# Altium schematic sheet SpeakeEasy_Logic.SchDoc
size A
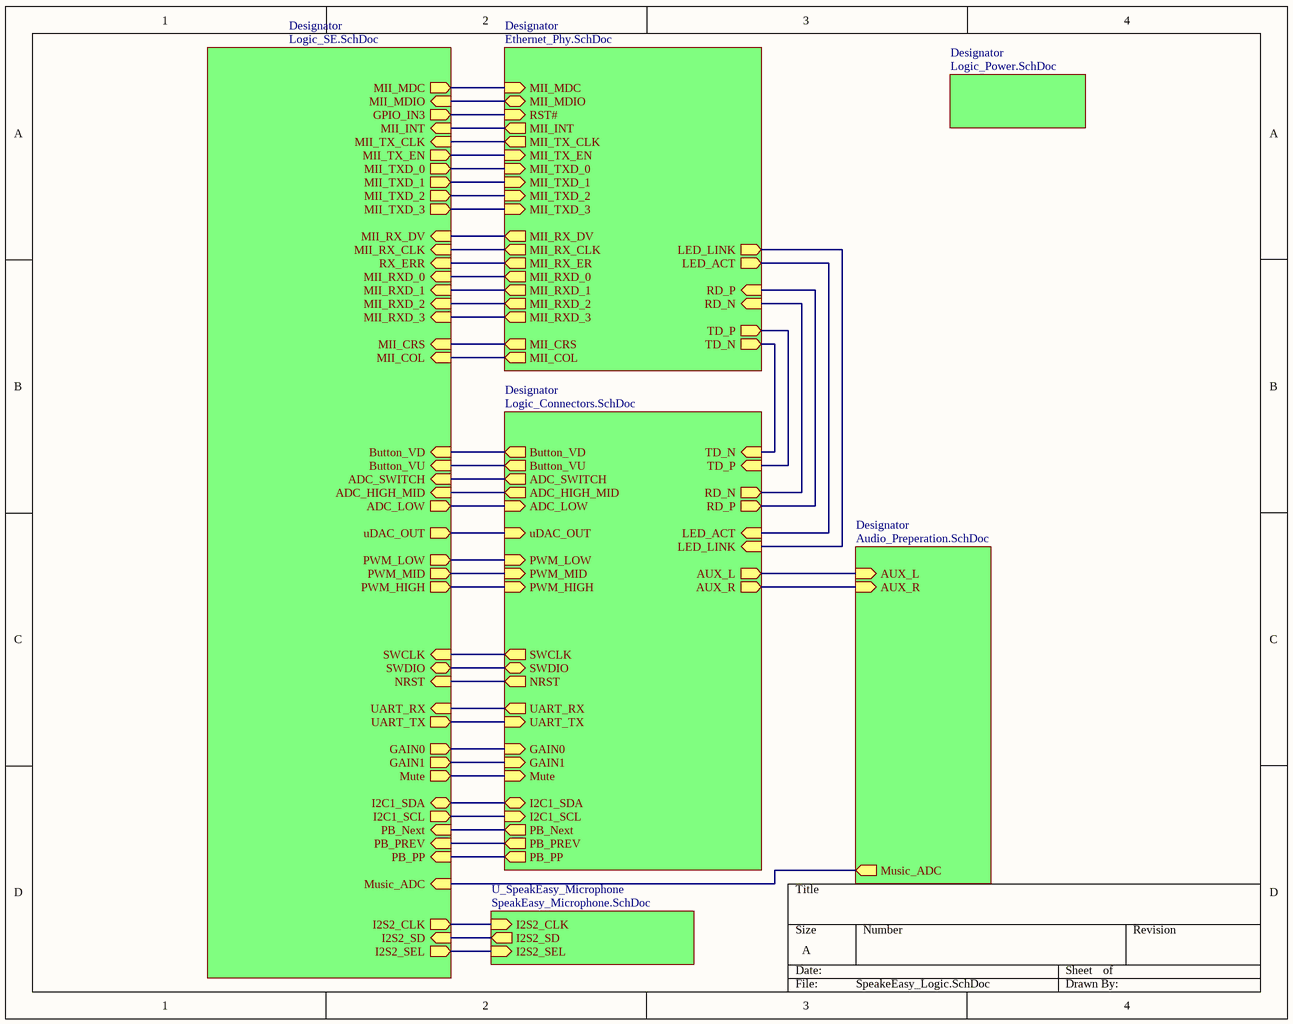
[diagram p0: SpeakeEasy_Logic.SchDoc]

## Sub-sheets
Designator = Logic_SE.SchDoc: MII_MDC (out), UART_RX (in), MII_TXD_2 (out), MII_CRS (in), I2C1_SCL (out), UART_TX (out), MII_TXD_0 (out), MII_MDIO (in), MII_COL (in), MII_TX_EN (out), MII_RX_DV (in), I2C1_SDA (bidir), MII_TXD_1 (out), MII_RX_CLK (in), MII_TXD_3 (out), MII_TX_CLK (in), GPIO_IN3 (out), PWM_LOW (out), PWM_HIGH (out), PWM_MID (out), Button_VD (in), Button_VU (in), uDAC_OUT (out), MII_RXD_0 (in), MII_RXD_3 (in), MII_RXD_2 (in), MII_RXD_1 (in), Music_ADC (in), SWDIO (bidir), SWCLK (in), NRST (in), GAIN1 (out), Mute (out), GAIN0 (out), ADC_HIGH_MID (in), ADC_SWITCH (in), ADC_LOW (out), PB_Next (in), PB_PP (in), PB_PREV (in), RX_ERR (in), I2S2_CLK (out), I2S2_SD (in), MII_INT (in), I2S2_SEL (out)
Designator = Ethernet_Phy.SchDoc: MII_MDC (in), MII_TXD_3 (in), MII_MDIO (bidir), MII_TXD_0 (in), RST# (in), MII_TX_CLK (out), MII_CRS (out), MII_RX_DV (out), MII_RX_CLK (out), MII_TX_EN (in), MII_TXD_1 (in), MII_TXD_2 (in), MII_RX_ER (out), MII_COL (out), LED_ACT (out), LED_LINK (out), TD_N (out), TD_P (out), RD_P (in), RD_N (in), MII_RXD_3 (out), MII_RXD_1 (out), MII_RXD_0 (out), MII_RXD_2 (out), MII_INT (out)
Designator = Logic_Connectors.SchDoc: Button_VD (out), TD_N (in), TD_P (in), LED_ACT (in), RD_N (out), RD_P (out), AUX_L (out), LED_LINK (in), AUX_R (out), Button_VU (out), PWM_LOW (in), PWM_HIGH (in), uDAC_OUT (in), PWM_MID (in), NRST (out), SWDIO (bidir), UART_TX (in), SWCLK (out), UART_RX (out), GAIN0 (in), GAIN1 (in), Mute (in), ADC_SWITCH (out), ADC_HIGH_MID (out), ADC_LOW (in), I2C1_SCL (in), I2C1_SDA (bidir), PB_PP (out), PB_Next (out), PB_PREV (out)
Designator = Logic_Power.SchDoc: no entries
Designator = Audio_Preperation.SchDoc: Music_ADC (out), AUX_L (in), AUX_R (in)
U_SpeakEasy_Microphone = SpeakEasy_Microphone.SchDoc: I2S2_SD (out), I2S2_CLK (in), I2S2_SEL (in)

## Nets
(unnamed): sheet Designator/MII_MDC, sheet Designator/MII_MDC
(unnamed): sheet Designator/UART_RX, sheet Designator/UART_RX
(unnamed): sheet Designator/MII_TXD_2, sheet Designator/MII_TXD_2
(unnamed): sheet Designator/MII_CRS, sheet Designator/MII_CRS
(unnamed): sheet Designator/I2C1_SCL, sheet Designator/I2C1_SCL
(unnamed): sheet Designator/UART_TX, sheet Designator/UART_TX
(unnamed): sheet Designator/MII_TXD_0, sheet Designator/MII_TXD_0
(unnamed): sheet Designator/MII_MDIO, sheet Designator/MII_MDIO
(unnamed): sheet Designator/MII_COL, sheet Designator/MII_COL
(unnamed): sheet Designator/MII_TX_EN, sheet Designator/MII_TX_EN
(unnamed): sheet Designator/MII_RX_DV, sheet Designator/MII_RX_DV
(unnamed): sheet Designator/I2C1_SDA, sheet Designator/I2C1_SDA
(unnamed): sheet Designator/MII_TXD_1, sheet Designator/MII_TXD_1
(unnamed): sheet Designator/MII_RX_CLK, sheet Designator/MII_RX_CLK
(unnamed): sheet Designator/MII_TXD_3, sheet Designator/MII_TXD_3
(unnamed): sheet Designator/MII_TX_CLK, sheet Designator/MII_TX_CLK
(unnamed): sheet Designator/GPIO_IN3, sheet Designator/RST#
(unnamed): sheet Designator/PWM_LOW, sheet Designator/PWM_LOW
(unnamed): sheet Designator/PWM_HIGH, sheet Designator/PWM_HIGH
(unnamed): sheet Designator/PWM_MID, sheet Designator/PWM_MID
(unnamed): sheet Designator/Button_VD, sheet Designator/Button_VD
(unnamed): sheet Designator/Button_VU, sheet Designator/Button_VU
(unnamed): sheet Designator/uDAC_OUT, sheet Designator/uDAC_OUT
(unnamed): sheet Designator/MII_RXD_0, sheet Designator/MII_RXD_0
(unnamed): sheet Designator/MII_RXD_3, sheet Designator/MII_RXD_3
(unnamed): sheet Designator/MII_RXD_2, sheet Designator/MII_RXD_2
(unnamed): sheet Designator/MII_RXD_1, sheet Designator/MII_RXD_1
(unnamed): sheet Designator/Music_ADC, sheet Designator/Music_ADC
(unnamed): sheet Designator/SWDIO, sheet Designator/SWDIO
(unnamed): sheet Designator/SWCLK, sheet Designator/SWCLK
(unnamed): sheet Designator/NRST, sheet Designator/NRST
(unnamed): sheet Designator/GAIN1, sheet Designator/GAIN1
(unnamed): sheet Designator/Mute, sheet Designator/Mute
(unnamed): sheet Designator/GAIN0, sheet Designator/GAIN0
(unnamed): sheet Designator/ADC_HIGH_MID, sheet Designator/ADC_HIGH_MID
(unnamed): sheet Designator/ADC_SWITCH, sheet Designator/ADC_SWITCH
(unnamed): sheet Designator/ADC_LOW, sheet Designator/ADC_LOW
(unnamed): sheet Designator/PB_Next, sheet Designator/PB_Next
(unnamed): sheet Designator/PB_PP, sheet Designator/PB_PP
(unnamed): sheet Designator/PB_PREV, sheet Designator/PB_PREV
(unnamed): sheet Designator/RX_ERR, sheet Designator/MII_RX_ER
(unnamed): sheet Designator/I2S2_CLK, sheet U_SpeakEasy_Microphone/I2S2_CLK
(unnamed): sheet Designator/I2S2_SD, sheet U_SpeakEasy_Microphone/I2S2_SD
(unnamed): sheet Designator/MII_INT, sheet Designator/MII_INT
(unnamed): sheet Designator/I2S2_SEL, sheet U_SpeakEasy_Microphone/I2S2_SEL
(unnamed): sheet Designator/LED_ACT, sheet Designator/LED_ACT
(unnamed): sheet Designator/LED_LINK, sheet Designator/LED_LINK
(unnamed): sheet Designator/TD_N, sheet Designator/TD_N
(unnamed): sheet Designator/TD_P, sheet Designator/TD_P
(unnamed): sheet Designator/RD_P, sheet Designator/RD_P
(unnamed): sheet Designator/RD_N, sheet Designator/RD_N
(unnamed): sheet Designator/AUX_L, sheet Designator/AUX_L
(unnamed): sheet Designator/AUX_R, sheet Designator/AUX_R